# Altium schematic sheet Bluetooth_LMC9830SM.SchDoc: Bluetooth (IEEE 802.15.1) Circuit
size A3; CompanyName: Altium Ltd; Organization: Altium Limited; Address1: L3, 12a Rodborough Rd; Address2: Frenchs Forest; Address3: NSW; Address4: Australia 2086; Revision: 1; SheetNumber: 4; SheetTotal: 7; PageSetup: Record=PageOptions|CenterHorizontal=True|CenterVertical=True|PrintScale=1.39|XCorrection=1.00|YCorrection=1.00|PrintKind=1|BorderSize=5000000|LeftOffset=0|BottomOffset=0|Orientation=2|PaperLength=1000|PaperWidth=1000|Scale=100|PaperSource=7|PrintQuality=1200|MediaType=1|DitherType=10|PaperKind=A3 (297 x 420 mm)|PrintScaleMode=1
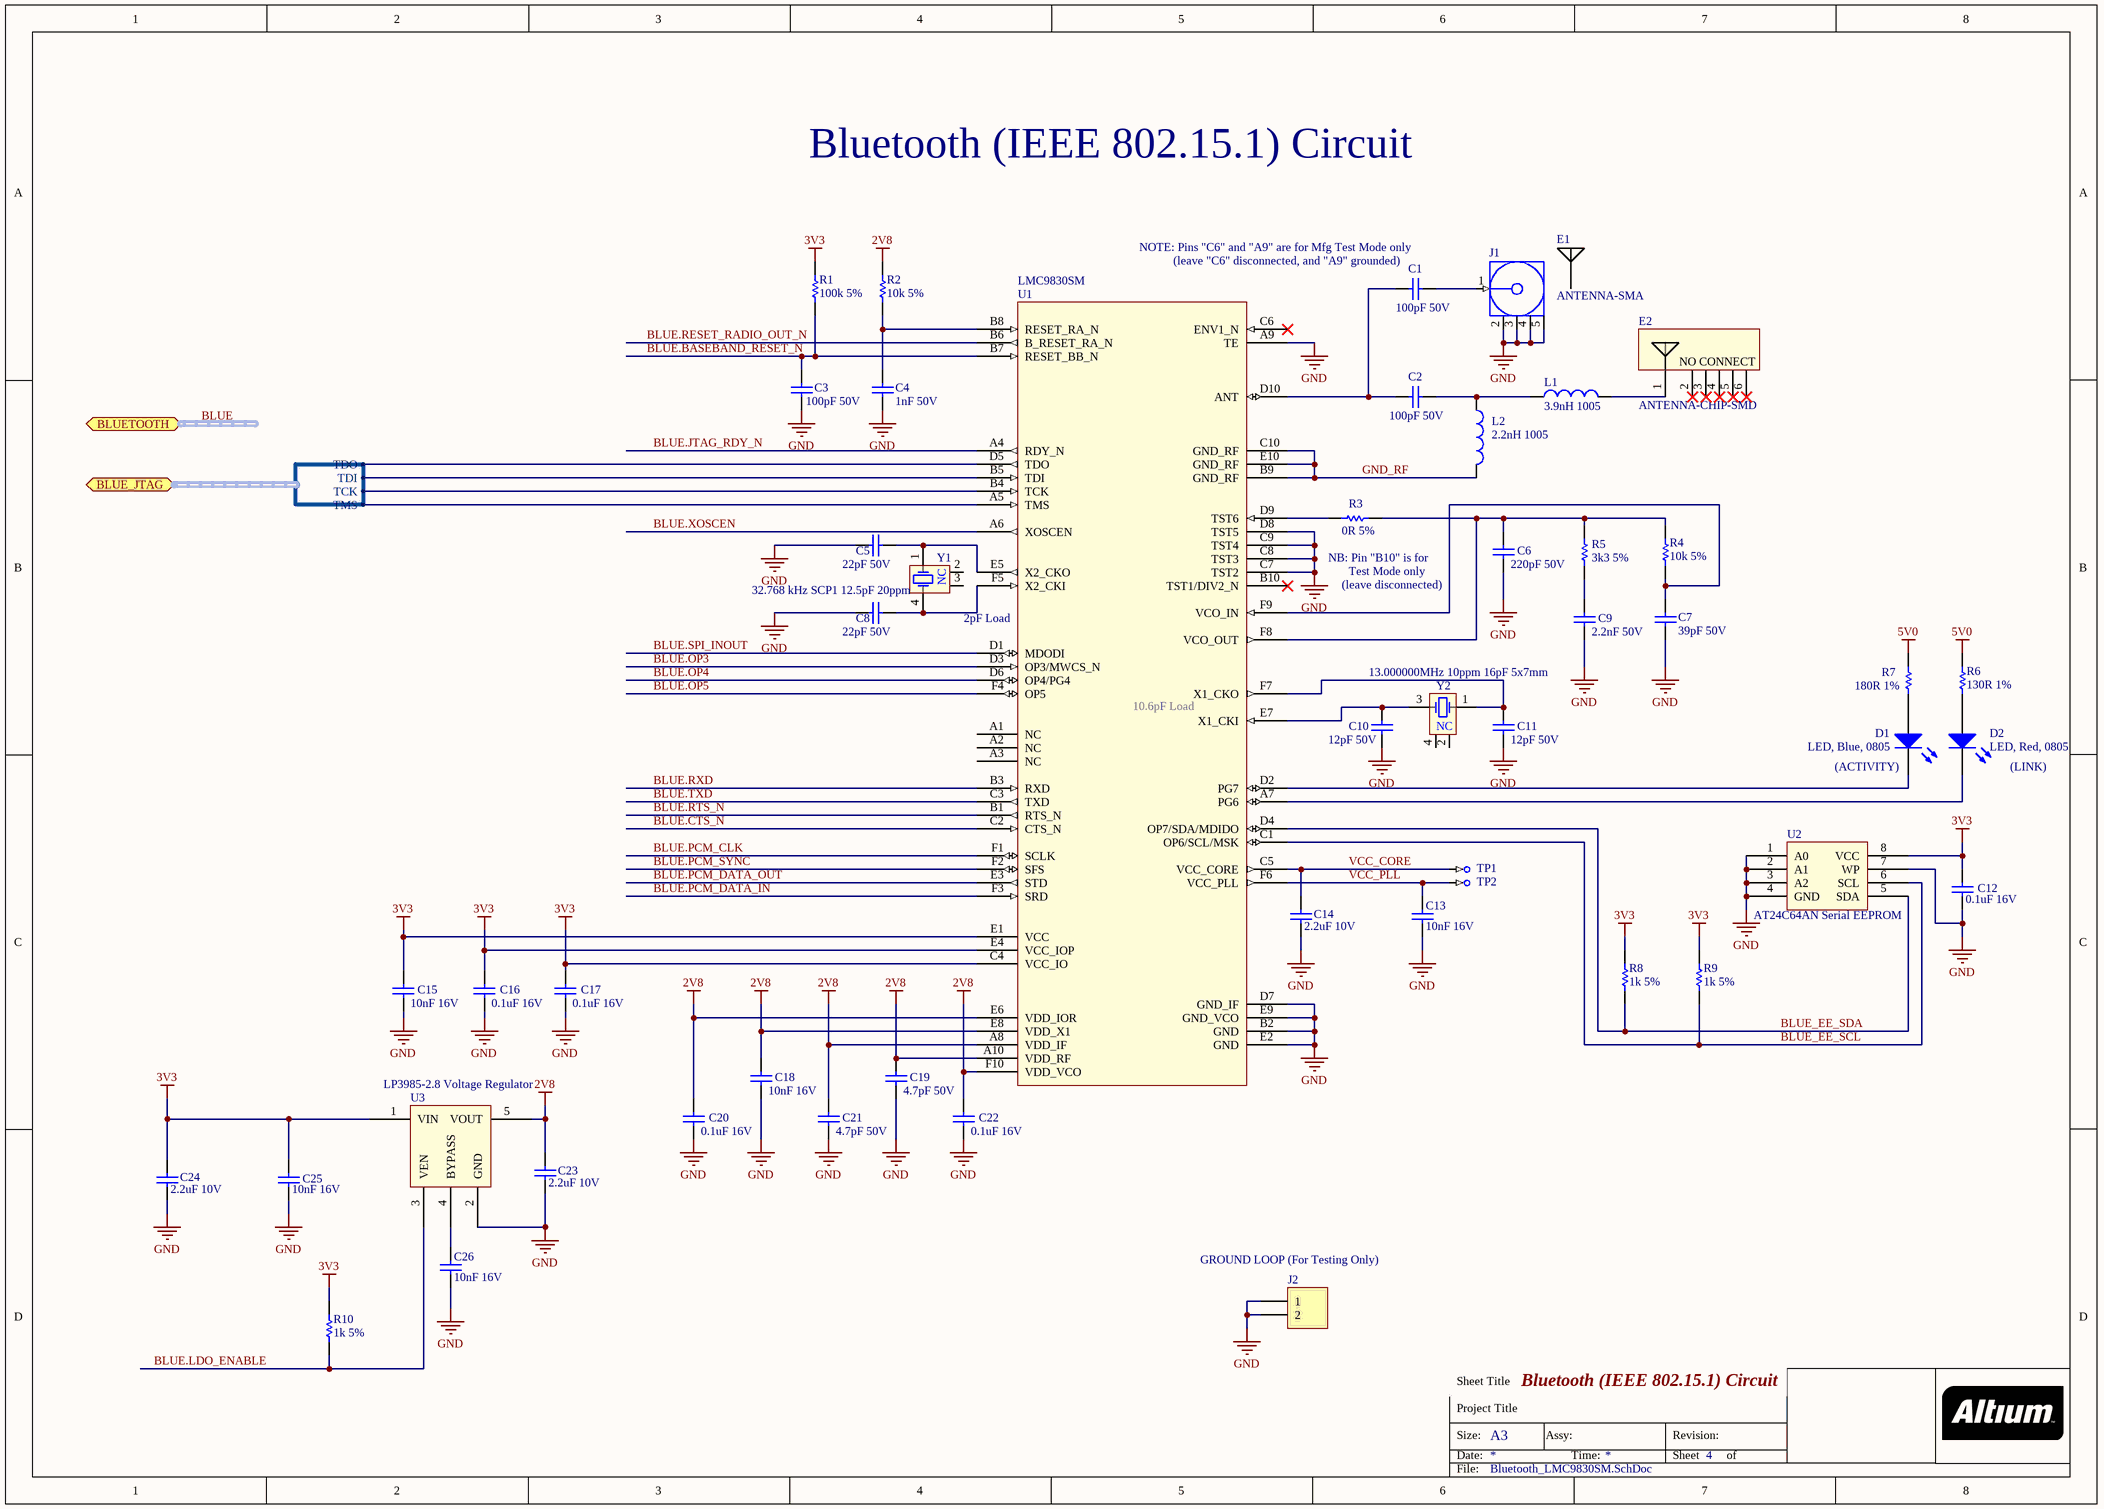
[diagram p0: Bluetooth_LMC9830SM.SchDoc]

## Parts
C1  100pF 50V  [CAPC1005-STAR]
C2  100pF 50V  [CAPC1005-STAR]
C3  100pF 50V  [CAPC1005-STAR]
C4  1nF 50V  [CAPC1005-STAR]
C5  22pF 50V  [CAPC1005-STAR]
C6  220pF 50V  [CAPC1005-STAR]
C7  39pF 50V  [CAPC1005-STAR]
C8  22pF 50V  [CAPC1005-STAR]
C9  2.2nF 50V  [CAPC1608-STAR]
C10  12pF 50V  [CAPC1005-STAR]
C11  12pF 50V  [CAPC1005-STAR]
C12  0.1uF 16V  [CAPC1005-STAR]
C13  10nF 16V  [CAPC1005-STAR]
C14  2.2uF 10V  [CAPC3216-STAR]
C15  10nF 16V  [CAPC1005-STAR]
C16  0.1uF 16V  [CAPC1005-STAR]
C17  0.1uF 16V  [CAPC1005-STAR]
C18  10nF 16V  [CAPC1005-STAR]
C19  4.7pF 50V  [CAPC1005-STAR]
C20  0.1uF 16V  [CAPC1005-STAR]
C21  4.7pF 50V  [CAPC1005-STAR]
C22  0.1uF 16V  [CAPC1005-STAR]
C23  2.2uF 10V  [CAPC3216-STAR]
C24  2.2uF 10V  [CAPC3216-STAR]
C25  10nF 16V  [CAPC1005-STAR]
C26  10nF 16V  [CAPC1005-STAR]
D1  LED, Blue, 0805  [LED2012-STAR]
D2  LED, Red, 0805  [LED2012-STAR]
E1  ANTENNA-SMA
E2  ANTENNA-CHIP-SMD  [ANTENNA-2-45GHZ-6PIN]
J1  SMA 5-pin Vertical Jack 50R  [HDR-SMA-THD-5-PIN]  (value not drawn)
J2  1x2 HEADER MALE  [HDR1X2]  (value not drawn)  (no BOM)
L1  3.9nH 1005  [INDC1005]
L2  2.2nH 1005  [INDC1005]
R1  100k 5%  [RESC1005-STAR]
R2  10k 5%  [RESC1005-STAR]
R3  0R 5%  [RESC1005-STAR]
R4  10k 5%  [RESC1005-STAR]
R5  3k3 5%  [RESC1005-STAR]
R6  130R 1%  [RESC1005-STAR]
R7  180R 1%  [RESC1005-STAR]
R8  1k 5%  [RESC1005-STAR]
R9  1k 5%  [RESC1005-STAR]
R10  1k 5%  [RESC1005-STAR]
TP1  TestPin  [TestPin]  (value not drawn)  (no BOM)
TP2  TestPin  [TestPin]  (value not drawn)  (no BOM)
U1  LMC9830SM  [BGA80P9X6-60]
U2  AT24C64AN Serial EEPROM  [SOIC8-150-BODY]
U3  LP3985-2.8 Voltage Regulator  [SOT-23-5]
Y1  32.768 kHz SCP1 12.5pF 20ppm  [XTAL-SCP1]
Y2  13.000000MHz 10ppm 16pF 5x7mm  [XTAL-7X5]

## Ports
BLUE_JTAG (harness JTAG), BLUETOOTH (harness BLUETOOTH)

## Harnesses
JTAG: TDO, TDI, TCK, TMS

## Nets
2V8: C18.1 C19.1 C20.1 C21.1 C22.1 C23.1 R2.1 U1.A8(VDD_IF) U1.A10(VDD_RF) U1.E6(VDD_IOR) U1.E8(VDD_X1) U1.F10(VDD_VCO) U3.5(VOUT)
3V3: C12.1 C15.1 C16.1 C17.1 C24.1 C25.1 R1.1 R8.1 R9.1 R10.1 U1.C4(VCC_IO) U1.E1(VCC) U1.E4(VCC_IOP) U2.8(VCC) U3.1(VIN)
5V0: R6.1 R7.1
GND: C3.1 C4.2 C5.1 C6.2 C7.2 C8.1 C9.2 C10.2 C11.2 C12.2 C13.2 C14.2 C15.2 C16.2 C17.2 C18.2 C19.2 C20.2 C21.2 C22.2 C23.2 C24.2 C25.2 C26.2 J1.2(GND) J1.3(GND) J1.4(GND) J1.5(GND) J2.1 J2.2 U1.A9(TE) U1.B2(GND) U1.C7(TST2) U1.C8(TST3) U1.C9(TST4) U1.D7(GND_IF) U1.D8(TST5) U1.E2(GND) U1.E9(GND_VCO) U2.1(A0) U2.2(A1) U2.3(A2) U2.4(GND) U2.7(WP) U3.2(GND)
BLUE.BASEBAND_RESET_N: C3.2 R1.2 U1.B7(RESET_BB_N)
BLUE.CTS_N: U1.C2(CTS_N)
BLUE.JTAG_RDY_N: U1.A4(RDY_N)
BLUE.LDO_ENABLE: R10.2 U3.3(VEN)
BLUE.OP3: U1.D3(OP3/MWCS_N)
BLUE.OP4: U1.D6(OP4/PG4)
BLUE.OP5: U1.F4(OP5)
BLUE.PCM_CLK: U1.F1(SCLK)
BLUE.PCM_DATA_IN: U1.F3(SRD)
BLUE.PCM_DATA_OUT: U1.E3(STD)
BLUE.PCM_SYNC: U1.F2(SFS)
BLUE.RESET_RADIO_OUT_N: U1.B6(B_RESET_RA_N)
BLUE.RTS_N: U1.B1(RTS_N)
BLUE.RXD: U1.B3(RXD)
BLUE.SPI_INOUT: U1.D1(MDODI)
BLUE.TXD: U1.C3(TXD)
BLUE.XOSCEN: U1.A6(XOSCEN)
BLUE_EE_SCL: R9.2 U1.C1(OP6/SCL/MSK) U2.6(SCL)
BLUE_EE_SDA: R8.2 U1.D4(OP7/SDA/MDIDO) U2.5(SDA)
GND_RF: L2.2 U1.B9(GND_RF) U1.C10(GND_RF) U1.E10(GND_RF)
VCC_CORE: C14.1 TP1.1 U1.C5(VCC_CORE)
VCC_PLL: C13.1 TP2.1 U1.F6(VCC_PLL)
NetC1_1: C1.1 C2.1 U1.D10(ANT)
NetC1_2: C1.2 J1.1(Signal)
NetC2_2: C2.2 L1.1 L2.1
NetC4_1: C4.1 R2.2 U1.B8(RESET_RA_N)
NetC5_2: C5.2 U1.E5(X2_CKO) Y1.1(X1)
NetC6_1: C6.1 R3.2 R4.1 R5.1 U1.F8(VCO_OUT)
NetC7_1: C7.1 R4.2 U1.F9(VCO_IN)
NetC8_2: C8.2 U1.F5(X2_CKI) Y1.4(X2)
NetC9_1: C9.1 R5.2
NetC10_1: C10.1 U1.E7(X1_CKI) Y2.3(X2)
NetC11_1: C11.1 U1.F7(X1_CKO) Y2.1(X1)
NetC26_1: C26.1 U3.4(BYPASS)
NetD1_1: D1.1(A) R7.2
NetD1_2: D1.2(K) U1.D2(PG7)
NetD2_1: D2.1(A) R6.2
NetD2_2: D2.2(K) U1.A7(PG6)
NetE2_1: E2.1 L1.2
NetR3_1: R3.1 U1.D9(TST6)
NetU1_A5: U1.A5(TMS) ; port BLUE_JTAG.TMS
NetU1_B4: U1.B4(TCK) ; port BLUE_JTAG.TCK
NetU1_B5: U1.B5(TDI) ; port BLUE_JTAG.TDI
NetU1_D5: U1.D5(TDO) ; port BLUE_JTAG.TDO

Not connected (* = marked no-connect by the designer): E2 2* 3* 4* 5* 6*; U1 A1(NC) A2(NC) A3(NC) B10(TST1/DIV2_N)* C6(ENV1_N)*; Y1 2(NC) 3(NC); Y2 2(NC) 4(NC)

## Buses and harness runs
harness BLUE = port BLUETOOTH

## Notes on the sheet
- Bluetooth (IEEE 802.15.1) Circuit
- NOTE: Pins "C6" and "A9" are for Mfg Test Mode only
- (near C1) (leave "C6" disconnected, and "A9" grounded)
- NB: Pin "B10" is for
- (leave disconnected)
- Test Mode only
- (near U1) 2pF Load
- (near U1) 10.6pF Load
- (near D1) (ACTIVITY)
- (near D2) (LINK)
- (near J2) GROUND LOOP (For Testing Only)
- Sheet Title
- Project Title
- Size:
- Date:
- A3
- Assy:
- Time:
- Revision:
- Sheet
- of
- File:
- (in symbol D-305-0001) NO CONNECT

## Library data of the parts
C1-C3 = D-101-0063: Capacitor, Ceramic, 100pF 5% 50V 0402 (1005) COG; Polarity: Non-Polarized; Capacitance: 100 pF; Dielectric: COG; Mounting Technology: Surface Mount; Rated Voltage: 50 V; Status: Unreleased; Technology: Ceramic; Tolerance: 5 %; Category: Capacitor
C4 = D-101-0030: Capacitor, Ceramic, 1nF 10% 50V 0402 (1005) X7R; Polarity: Non-Polarized; Capacitance: 1 nF; Dielectric: X7R; Mounting Technology: Surface Mount; Rated Voltage: 50 V; Status: Production; Technology: Ceramic; Tolerance: 10 %; Category: Capacitor
C5 C8 = D-101-0059: Capacitor, Ceramic, 22pF 5% 50V 0402 (1005) COG; Polarity: Non-Polarized; Capacitance: 22 pF; Dielectric: COG; Mounting Technology: Surface Mount; Rated Voltage: 50 V; Status: Unreleased; Technology: Ceramic; Tolerance: 5 %; Category: Capacitor
C6 = D-101-0064: Capacitor, Ceramic, 220pF 5% 50V 0402 (1005) COG; Polarity: Non-Polarized; Capacitance: 220 pF; Dielectric: COG; Mounting Technology: Surface Mount; Rated Voltage: 50 V; Status: Unreleased; Technology: Ceramic; Tolerance: 5 %; Category: Capacitor
C7 = D-101-0060: Capacitor, Ceramic, 39pF 5% 50V 0402 (1005) COG; Polarity: Non-Polarized; Capacitance: 39 pF; Dielectric: COG; Mounting Technology: Surface Mount; Rated Voltage: 50 V; Status: Unreleased; Technology: Ceramic; Tolerance: 5 %; Category: Capacitor
C9 = D-101-0065: Capacitor, Ceramic, 2.2nF 10% 50V 0603 (1608) X7R; Polarity: Non-Polarized; Capacitance: 2.2 nF; Dielectric: X7R; Mounting Technology: Surface Mount; Rated Voltage: 50 V; Status: Unreleased; Technology: Ceramic; Tolerance: 10 %; Category: Capacitor
C10 C11 = D-101-0058: Capacitor, Ceramic, 12pF 2% 50V 0402 (1005) COG; Polarity: Non-Polarized; Capacitance: 12 pF; Dielectric: COG; Mounting Technology: Surface Mount; Rated Voltage: 50 V; Status: Unreleased; Technology: Ceramic; Tolerance: 2 %; Category: Capacitor
C12 C16 C17 C20 C22 = D-101-0080: Capacitor, Ceramic, 0.1uF 10% 16V 0402 (1005) X7R; Polarity: Non-Polarized; Capacitance: 0.1 uF; Dielectric: X7R; Mounting Technology: Surface Mount; Rated Voltage: 16 V; Status: Production; Technology: Ceramic; Tolerance: 10 %; Category: Capacitor
C13 C15 C18 C25 C26 = D-101-0077: Capacitor, Ceramic, 10nF 10% 16V 0402 (1005) X7R; Polarity: Non-Polarized; Capacitance: 10 nF; Dielectric: X7R; Mounting Technology: Surface Mount; Rated Voltage: 16 V; Status: Production; Technology: Ceramic; Tolerance: 10 %; Category: Capacitor
C14 C23 C24 = D-101-0053: Capacitor, Ceramic, 2.2uF 10% 10V 1206 (3216) X7R; Polarity: Non-Polarized; Capacitance: 2.2 uF; Dielectric: X7R; Mounting Technology: Surface Mount; Rated Voltage: 10 V; Status: Unreleased; Technology: Ceramic; Tolerance: 10 %; Category: Capacitor
C19 C21 = D-101-0054: Capacitor, Ceramic, 4.7pF 5% 50V 0402 (1005) COG; Polarity: Non-Polarized; Capacitance: 4.7 pF; Dielectric: COG; Mounting Technology: Surface Mount; Rated Voltage: 50 V; Status: Unreleased; Technology: Ceramic; Tolerance: 5 %; Category: Capacitor
D1 = D-153-0005: LED, Blue 0805 (2012); Brightness: 35 mcd; Peak Wave Length: 468 nm; Color: Blue; Mounting Technology: Surface Mount; Status: Production; Category: LED
D2 = D-153-0003: LED, Red 0805 (2012) HSMH-C170; Brightness: 17 mcd; Peak Wave Length: 639 nm; Color: N/A; Mounting Technology: Surface Mount; Status: Production; Category: LED
E1 = D-305-0000: Antenna, 2.45GHz 1/4 Wave 50R SMA Antenna; Impedence: 50 Ohms; Status: Unreleased; Category: Antenna; Nominal Fequency: 2.45 GHz
E2 = D-305-0001: Antenna, 2.45GHz Chip SMD 5.5 X 7.35MM; Impedence: 50 Ohms; Status: Unreleased; Category: Antenna; Nominal Fequency: 2.45 GHz
J1 = D-300-0035: SMA RF Coaxial PCB Connector, 5-pin Through-hole, Vertical Mount Socket, 50 ohm impedance; Connector type: Straight; Max Current: mA; Mounting Technology: Through-Hole; Pin Count: 5; Status: Unreleased; Category: Connector
J2 = D-300-0020: Header IDC, 2 x 1 Pin Vertical 2.54mm Pitch (Non-Boxed, Male); Max Current: 3 A; Connector type: Header; Mounting Technology: Through-Hole; Pin Count: 2; Status: Production; Category: Connector
L1 = D-102-0008: Inductor, Chip 3.9nH 300mA DCR=0.18 ohm, High Frequency 0402 (1005); Inductance: 3.9 nH; Max Input Current: 300 mA; Mounting Technology: Surface Mount; Status: Unreleased; Category: Inductor
L2 = D-102-0007: Inductor, Chip 2.2nH 300mA DCR=0.12 ohm, High Frequency 0402 (1005); Inductance: 2.2 nH; Max Input Current: 300 mA; Mounting Technology: Surface Mount; Status: Unreleased; Category: Inductor
R1 = D-100-0072: Resistor, 100k 5% 0402 (1005); Power Rating: 63 mW; Mounting Technology: Surface Mount; Resistance: 100 K; Status: Unreleased; Tolerance: 5 %; Category: Resistor
R2 R4 = D-100-0069: Resistor, 10k 5% 0402 (1005); Power Rating: 63 mW; Mounting Technology: Surface Mount; Resistance: 10 K; Status: Unreleased; Tolerance: 5 %; Category: Resistor
R3 = D-100-0137: Resistor, 0R 5% 0402 (1005); Power Rating: 63 mW; Mounting Technology: Surface Mount; Resistance: 0 R; Status: Unreleased; Tolerance: 5 %; Category: Resistor
R5 = D-100-0068: Resistor, 3k3 5% 0402 (1005); Power Rating: 63 mW; Resistance: 3.3 K; Mounting Technology: Surface Mount; Status: Unreleased; Tolerance: 5 %; Category: Resistor
R6 = D-100-0143: Resistor, 130R 1% 0402 (1005); Power Rating: 63 mW; Mounting Technology: Surface Mount; Resistance: 130 R; Status: Unreleased; Tolerance: 1 %; Category: Resistor
R7 = D-100-0123: Resistor, 180R 1% 0402 (1005); Power Rating: 63 mW; Mounting Technology: Surface Mount; Resistance: 180 R; Status: Production; Tolerance: 1 %; Category: Resistor
R8-R10 = D-100-0066: Resistor, 1k 5% 0402 (1005); Power Rating: 63 mW; Mounting Technology: Surface Mount; Resistance: 1 K; Status: Unreleased; Tolerance: 5 %; Category: Resistor
TP1 TP2 = D-006-0000: Test Point, PCB Mount with Silkscreen Box; Status: Production; Category: Test-Point
U1 = D-221-0006: LMC9830SM, 2.45GHz Bluetooth Serial Port Module, BGA60; Comm Standard: Bluetooth; Mounting Technology: Surface Mount; Status: Unreleased; Category: IC-Communication
U2 = D-263-0001: AT24C64AN Two-Wire Serial EEPROM 2.7-5.5V SOIC-8 (JEDEC); Bit Length: 8192 x 8 Bits; Bit Width: 1 Bits; Speed: ps; Supply Voltage: 2.7 to 5.5 V; Mounting Technology: Surface Mount; Status: Unreleased; Technology: EE; Category: IC-PROM
U3 = D-204-0005: LP3985IM5-2.8, 2V8 Voltage Regulator, Low-Noise Ultra Low-Dropout, 150mA, SOT-23-5; Max Input Voltage: 6 V; Max Output Voltage: 2.803 V; Min Input Voltage: 3.3 V; Min Output Voltage: 2.797 V; Supply Voltage: mV; Max Output Current: 150 mA; Mounting Technology: Surface Mount; Status: Unreleased; Category: IC-Power
Y1 = D-103-0017: Crystal, 32.768 kHz, Surface Mount SCP1, 12.5pF, 20ppm; Frequency Stability: parabolic ppm; Nominal Operational Voltage: mV; Frequency Tolerance: 20 ppm; Load Capacitance: 12.5 pF; Mounting Technology: Surface Mount; Nominal Fequency: 32.768 KHz; Status: Unreleased; Category: Crystal
Y2 = D-103-0018: Crystal, 13.000000MHz, 5x7mm, 10ppm 10ppm 16pF; Nominal Fequency: 13 MHz; Nominal Operational Voltage: mV; Frequency Stability: 10 ppm; Frequency Tolerance: 10 ppm; Load Capacitance: 16 pF; Mounting Technology: Surface Mount; Status: Unreleased; Category: Crystal